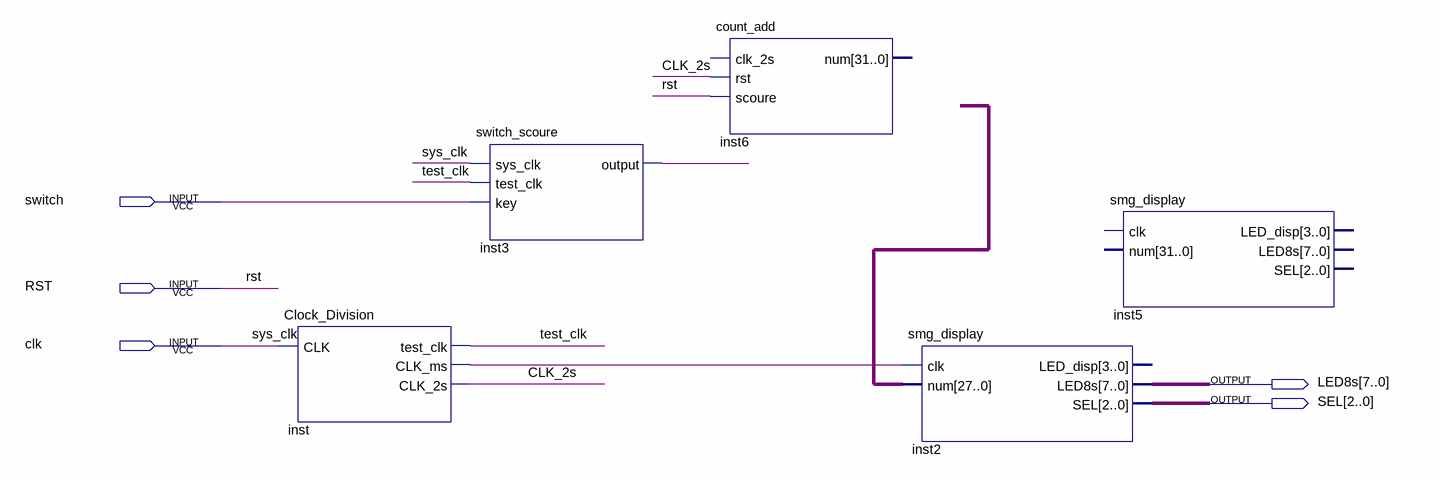
[diagram p0: schematic sheet]
// Quartus schematic mea.bdf as structural Verilog: 5 symbols, 5 pins
module mea (
  input  switch,
  input  RST,
  input  clk,
  output [7:0] LED8s,
  output [2:0] SEL
);

  wire CLK_2s, inst3_output, inst_clk_ms, test_clk;
  wire [27:0] undriven;

  Clock_Division inst (.CLK(clk), .test_clk(test_clk), .CLK_ms(inst_clk_ms), .CLK_2s(CLK_2s));
  switch_scoure inst3 (.sys_clk(clk), .test_clk(test_clk), .key(switch), .\output (inst3_output));
  count_add inst6 (.rst(CLK_2s), .scoure(RST));  // open: clk_2s, num
  smg_display inst2 (.clk(inst_clk_ms), .num(undriven), .LED8s(LED8s), .SEL(SEL));  // open: LED_disp
  smg_display inst5 ();  // open: clk, num, LED_disp, LED8s, SEL

  // Other names for the same wires on the sheet: sys_clk = clk
endmodule
